# Altium project TestingPowerBoard.PrjPcb
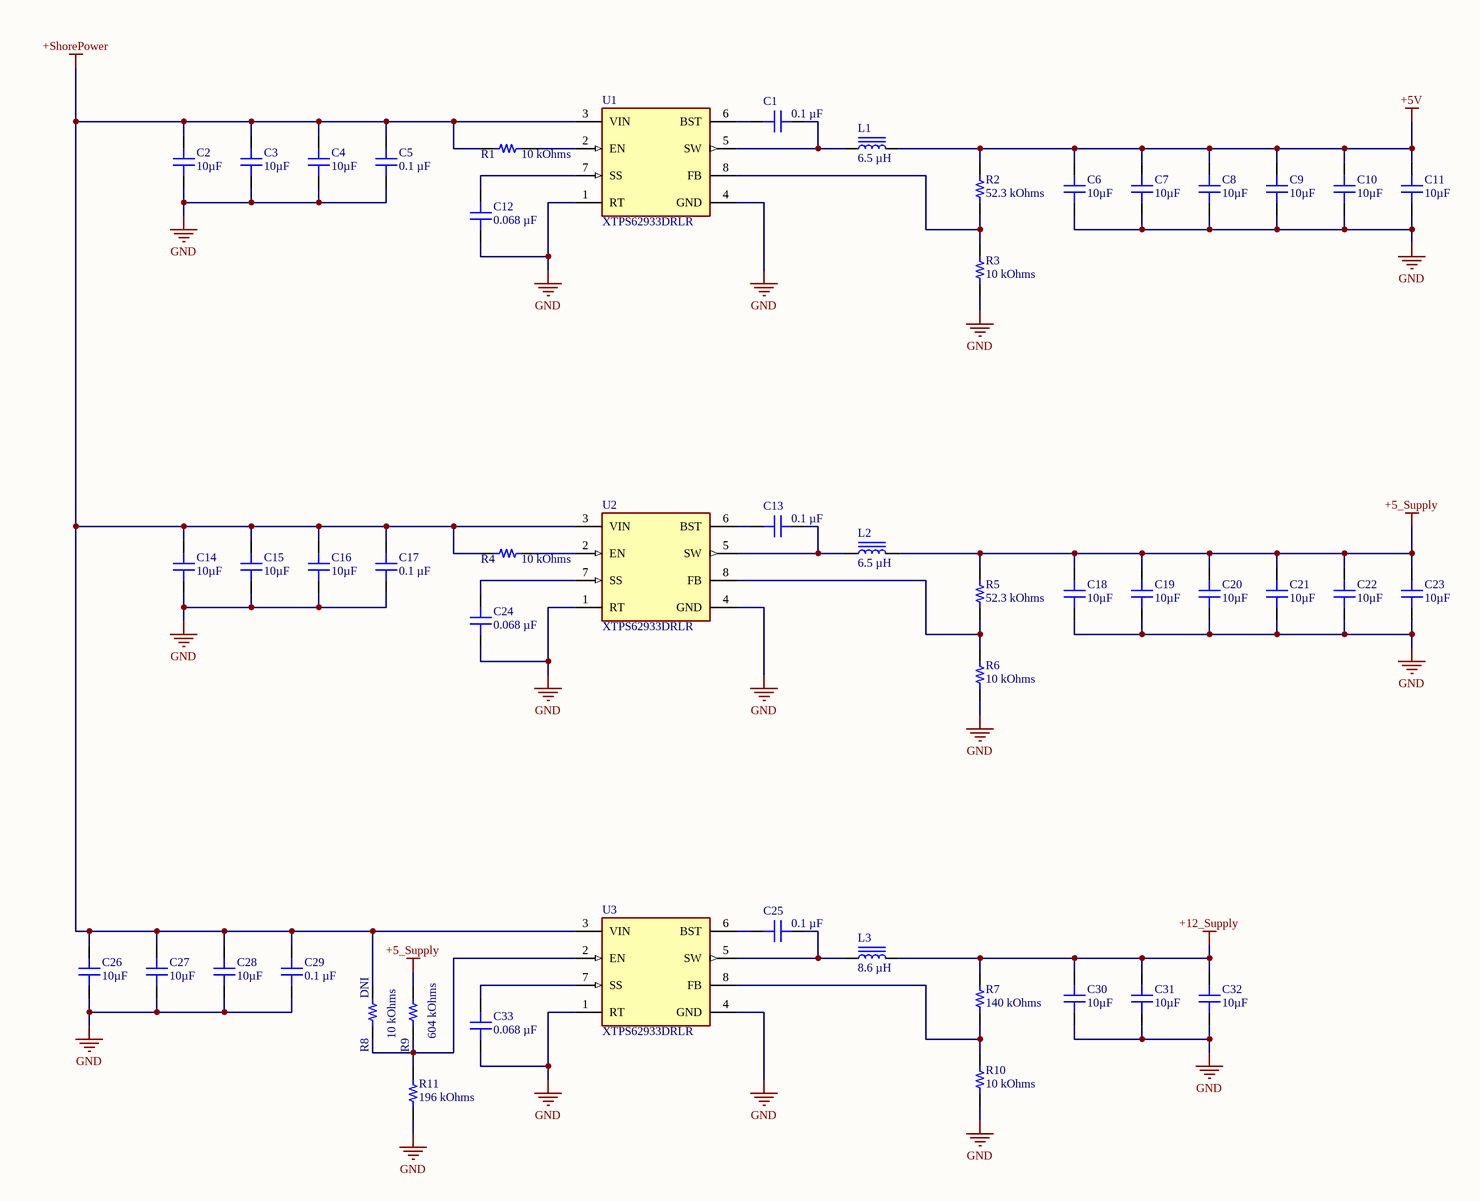
[diagram p0: Power-Supplies.SchDoc]
4 sheets, 110 parts. Net scope: flat (ports and power ports of the same name join across sheets).
Board file: TestingPowerBoard.PcbDoc
Sheets:
  Power-Supplies.SchDoc
  Interfaces.SchDoc
  Sensors.SchDoc
  Microcontroller.SchDoc

## Sheet Power-Supplies.SchDoc: Payload Card 5V Rail Power Supplies
size A2; Revision: 1A; SheetNumber: 1; SheetTotal: 3; Organization: Brickworks; Address1: Matthew Glazer; Address2: Design Engineer

### Parts
C1  0.1 µF  [CAP 0603_1608]
C2  10µF  [CAP 0805_2012]
C3  10µF  [CAP 0805_2012]
C4  10µF  [CAP 0805_2012]
C5  0.1 µF  [CAP 0603_1608]
C6  10µF  [CAP 0805_2012]
C7  10µF  [CAP 0805_2012]
C8  10µF  [CAP 0805_2012]
C9  10µF  [CAP 0805_2012]
C10  10µF  [CAP 0805_2012]
C11  10µF  [CAP 0805_2012]
C12  0.068 µF  [CAP 0603_1608]
C13  0.1 µF  [CAP 0603_1608]
C14  10µF  [CAP 0805_2012]
C15  10µF  [CAP 0805_2012]
C16  10µF  [CAP 0805_2012]
C17  0.1 µF  [CAP 0603_1608]
C18  10µF  [CAP 0805_2012]
C19  10µF  [CAP 0805_2012]
C20  10µF  [CAP 0805_2012]
C21  10µF  [CAP 0805_2012]
C22  10µF  [CAP 0805_2012]
C23  10µF  [CAP 0805_2012]
C24  0.068 µF  [CAP 0603_1608]
C25  0.1 µF  [CAP 0603_1608]
C26  10µF  [CAP 0805_2012]
C27  10µF  [CAP 0805_2012]
C28  10µF  [CAP 0805_2012]
C29  0.1 µF  [CAP 0603_1608]
C30  10µF  [CAP 0805_2012]
C31  10µF  [CAP 0805_2012]
C32  10µF  [CAP 0805_2012]
C33  0.068 µF  [CAP 0603_1608]
L1  6.5 µH  [TAIYO YUDEN NR1005]
L2  6.5 µH  [TAIYO YUDEN NR1005]
L3  8.6 µH  [BOURNS SRR6028]
R1  10 kOhms  [RES 0603_1608]
R2  52.3 kOhms  [RES 0603_1608]
R3  10 kOhms  [RES 0603_1608]
R4  10 kOhms  [RES 0603_1608]
R5  52.3 kOhms  [RES 0603_1608]
R6  10 kOhms  [RES 0603_1608]
R7  140 kOhms  [RES 0603_1608]
R8  10 kOhms  [RES 0603_1608]
R9  604 kOhms  [RES 0603_1608]
R10  10 kOhms  [RES 0603_1608]
R11  196 kOhms  [RES 0603_1608]
U1  XTPS62933DRLR  [FP-DRL0008A-MFG]
U2  XTPS62933DRLR  [FP-DRL0008A-MFG]
U3  XTPS62933DRLR  [FP-DRL0008A-MFG]

### Nets
+5_Supply: C18.2 C19.2 C20.2 C21.2 C22.2 C23.2 L2.2 R5.2 R9.2
+5V: C6.2 C7.2 C8.2 C9.2 C10.2 C11.2 L1.2 R2.2
+12_Supply: C30.2 C31.2 C32.2 L3.2 R7.2
+ShorePower: C2.2 C3.2 C4.2 C5.1 C14.2 C15.2 C16.2 C17.1 C26.2 C27.2 C28.2 C29.1 R1.1 R4.1 R8.2 U1.3(VIN) U2.3(VIN) U3.3(VIN)
GND: C2.1 C3.1 C4.1 C5.2 C6.1 C7.1 C8.1 C9.1 C10.1 C11.1 C12.1 C14.1 C15.1 C16.1 C17.2 C18.1 C19.1 C20.1 C21.1 C22.1 C23.1 C24.1 C26.1 C27.1 C28.1 C29.2 C30.1 C31.1 C32.1 C33.1 R3.1 R6.1 R10.1 R11.1 U1.1(RT) U1.4(GND) U2.1(RT) U2.4(GND) U3.1(RT) U3.4(GND)
NetC1_1: C1.1 L1.1 U1.5(SW)
NetC1_2: C1.2 U1.6(BST)
NetC12_2: C12.2 U1.7(SS)
NetC13_1: C13.1 L2.1 U2.5(SW)
NetC13_2: C13.2 U2.6(BST)
NetC24_2: C24.2 U2.7(SS)
NetC25_1: C25.1 L3.1 U3.5(SW)
NetC25_2: C25.2 U3.6(BST)
NetC33_2: C33.2 U3.7(SS)
NetR1_2: R1.2 U1.2(EN)
NetR2_1: R2.1 R3.2 U1.8(FB)
NetR4_2: R4.2 U2.2(EN)
NetR5_1: R5.1 R6.2 U2.8(FB)
NetR7_1: R7.1 R10.2 U3.8(FB)
NetR8_1: R8.1 R9.1 R11.2 U3.2(EN)

### Notes on the sheet
- (near R8) DNI
- Title
- Size:
- Date:
- File:
- A2
- Number:
- Time:
- Revision:
- Sheet
- of

### Library data of the parts
C1 C5 C13 C17 C25 C29 = CL10B104KB8NNWC: CAP CER 0.1UF 50V X7R 0603; manufacturer: Samsung Electro-Mechanics; Tolerance: ±10%; Part Number: CL10B104KB8NNWC; Value: 0.1 µF; Applications: General Purpose; Capacitance: 0.1 µF; componentlink1description: Datasheet; componentlink1url: http://www.samsungsem.com/kr/support/product-search/mlcc/CL10B104KB8NNWC.jsp; componentlink2description: DigiKey Link; componentlink2url: https://www.digikey.com/en/products/detail/samsung-electro-mechanics/CL10B104KB8NNWC/3887593; Device Package: 0603 (1608 Metric); lastupdated: 3/8/2022 9:16:52 PM; Lifecycle Status: Active; Minimum Order: 1; Mounting Type: Surface Mount, MLCC; Operating Temperature: -55°C ~ 125°C; Package / Case: 0603 (1608 Metric); packaging: CutTape; partid: 16078; Part Status: Active; price: 0.01; series: CL; Size / Dimension: 0.063" L x 0.031" W (1.60mm x 0.80mm); Supplier 1: DigiKey; Supplier Part Number 1: 1276-1935-1-ND; Temperature Coefficient: X7R; Thickness (Max): 0.035" (0.90mm); Voltage - Rated: 50V
C2-C4 C6-C11 C14-C16 C18-C23 C26-C28 C30-C32 = CC0805KKX5R7BB106: CAP CER 10UF 16V X5R 0805; Manufacturer: Yageo; Tolerance: ±10%; Part Number: CC0805KKX5R7BB106; Value: 10µF; Applications: General Purpose; Capacitance: 10µF; ComponentLink1Description: Datasheet; ComponentLink1URL: https://www.yageo.com/upload/media/product/productsearch/datasheet/mlcc/UPY-GPHC_X5R_4V-to-50V_25.pdf; ComponentLink2Description: DigiKey Link; ComponentLink2URL: http://digikey.com/product-detail/en/yageo/CC0805KKX5R7BB106/311-1865-1-ND/5195767; Device Package: 0805 (2012 Metric); LastUpdated: 9/2/2020 1:04:30 AM; Lifecycle Status: Active; Minimum Order: 1; Mounting Type: Surface Mount, MLCC; Operating Temperature: -55°C ~ 85°C; Package / Case: 0805 (2012 Metric); Packaging: TapeAndReel; PartId: 8867; Part Status: Active; Price: 0.09; Series: CC; Size / Dimension: 0.079" L x 0.049" W (2.00mm x 1.25mm); Supplier 1: DigiKey; Supplier Part Number 1: 311-1865-1-ND; Temperature Coefficient: X5R; Thickness (Max): 0.057" (1.45mm); Voltage - Rated: 16V
C12 C24 C33 = CC0603KRX7R8BB683: CAP CER 0.068UF 25V X7R 0603; manufacturer: Yageo; Tolerance: ±10%; Part Number: CC0603KRX7R8BB683; Value: 0.068 µF; Applications: General Purpose; Capacitance: 0.068 µF; componentlink1description: Datasheet; componentlink1url: https://www.yageo.com/upload/media/product/productsearch/datasheet/mlcc/UPY-GPHC_X7R_6.3V-to-50V_18.pdf; componentlink2description: DigiKey Link; componentlink2url: https://www.digikey.com/en/products/detail/yageo/CC0603KRX7R8BB683/5883792; Device Package: 0603 (1608 Metric); lastupdated: 3/17/2022 8:26:41 AM; Lifecycle Status: Active; Minimum Order: 1; Mounting Type: Surface Mount, MLCC; Operating Temperature: -55°C ~ 125°C; Package / Case: 0603 (1608 Metric); packaging: TapeAndReel; partid: 13821; Part Status: Active; price: 0.01; series: CC; Size / Dimension: 0.063" L x 0.031" W (1.60mm x 0.80mm); Supplier 1: DigiKey; Supplier Part Number 1: 311-4091-1-ND; Temperature Coefficient: X7R; Thickness (Max): 0.035" (0.90mm); Voltage - Rated: 25V
L1 L2 = NR10050T6R5N: FIXED IND 6.5UH 5.2A 23.4MOHM SM; Manufacturer: Taiyo Yuden; Current - Saturation: 6A; DC Resistance (DCR): 23.4mOhm Max; Frequency - Self Resonant: 19MHz; Inductance Frequency - Test: 100 kHz; Material - Core: Ferrite; Shielding: Shielded; Tolerance: ±30%; Type: Wirewound; Part Number: NR10050T6R5N; ComponentLink1Description: Datasheet; ComponentLink1URL: https://ds.yuden.co.jp/TYCOMPAS/ut/detail?pn=NR10050T6R5N  &u=M; ComponentLink2Description: DigiKey Link; ComponentLink2URL: https://www.digikey.com/en/products/detail/taiyo-yuden/NR10050T6R5N/1007971; Current Rating (Amps): 5.2 A; Device Package: Nonstandard; Height - Seated (Max): 0.197" (5.00mm); Inductance: 6.5 µH; LastUpdated: 3/17/2022 9:14:25 AM; Lifecycle Status: Active; Minimum Order: 1; Mounting Type: Surface Mount; Operating Temperature: -25°C ~ 105°C; Package / Case: Nonstandard; Packaging: TapeAndReel; PartId: 3626; Part Status: Active; Price: 0.51; Series: NR; Size / Dimension: 0.394" L x 0.386" W (10.00mm x 9.80mm); Supplier 1: DigiKey; Supplier Part Number 1: 587-1697-1-ND; Value: 6.5 µH
L3 = SRR6028-8R6Y: FIXED IND 8.6UH 2.1A 56 MOHM SMD; Manufacturer: Bourns Inc.; Current - Saturation: 1.82A; DC Resistance (DCR): 56mOhm Max; Frequency - Self Resonant: 28MHz; Inductance Frequency - Test: 100 kHz; Material - Core: Ferrite; Q @ Freq: 8 @ 2.52MHz; Shielding: Shielded; Tolerance: ±30%; Type: Wirewound; Part Number: SRR6028-8R6Y; ComponentLink1Description: Datasheet; ComponentLink1URL: https://www.bourns.com/docs/Product-Datasheets/SRR6028.pdf; ComponentLink2Description: DigiKey Link; ComponentLink2URL: https://www.digikey.com/en/products/detail/bourns-inc/SRR6028-8R6Y/1970374; Current Rating (Amps): 2.1 A; Device Package: Nonstandard; Height - Seated (Max): 0.118" (3.00mm); Inductance: 8.6 µH; LastUpdated: 3/17/2022 9:03:42 AM; Lifecycle Status: Active; Minimum Order: 1; Mounting Type: Surface Mount; Operating Temperature: -40°C ~ 125°C; Package / Case: Nonstandard; Packaging: TapeAndReel; PartId: 46; Part Status: Active; Price: 0.45; Series: SRR6028; Size / Dimension: 0.268" L x 0.268" W (6.80mm x 6.80mm); Supplier 1: DigiKey; Supplier Part Number 1: SRR6028-8R6YCT-ND; Value: 8.6 µH
R1 R3 R4 R6 R8 R10 = RMCF0603JT10K0: RES 10K OHM 5% 1/10W 0603; Manufacturer: Stackpole Electronics Inc; Power (Watts): 0.1W, 1/10W; Temperature Coefficient: ±200ppm/°C; Part Number: RMCF0603JT10K0; Value: 10 kOhms; ComponentLink1Description: Datasheet; ComponentLink1URL: https://www.seielect.com/catalog/sei-packaging.pdf; ComponentLink2Description: DigiKey Link; ComponentLink2URL: http://digikey.com/product-detail/en/stackpole-electronics-inc/RMCF0603JT10K0/RMCF0603JT10K0CT-ND/1943191; Composition: Thick Film; Device Package: 0603 (1608 Metric); Features: Automotive AEC-Q200; Height - Seated (Max): 0.022" (0.55mm); LastUpdated: 8/30/2020 8:48:45 PM; Lifecycle Status: Active; Minimum Order: 1; Number of Terminations: 2; Operating Temperature: -55°C ~ 155°C; Package / Case: 0603 (1608 Metric); Packaging: CutTape; PartId: 25659; Part Status: Active; Price: 0.10; Ratings: AEC-Q200; Resistance: 10 kOhms; Series: RMCF; Size / Dimension: 0.061" L x 0.031" W (1.55mm x 0.80mm); Supplier 1: DigiKey; Supplier Part Number 1: RMCF0603JT10K0CT-ND; Supplier Device Package: 0603; Tolerance: ±5%
R2 R5 = RMCF0603FT52K3: RES 52.3K OHM 1% 1/10W 0603; Manufacturer: Stackpole Electronics Inc; Power (Watts): 0.1W, 1/10W; Temperature Coefficient: ±100ppm/°C; Part Number: RMCF0603FT52K3; Value: 52.3 kOhms; ComponentLink1Description: Datasheet; ComponentLink1URL: https://www.seielect.com/catalog/sei-rmcf_rmcp.pdf; ComponentLink2Description: DigiKey Link; ComponentLink2URL: https://www.digikey.com/en/products/detail/stackpole-electronics-inc/RMCF0603FT52K3/1714113; Composition: Thick Film; Device Package: 0603 (1608 Metric); Features: Automotive AEC-Q200; Height - Seated (Max): 0.022" (0.55mm); LastUpdated: 3/17/2022 8:41:15 AM; Lifecycle Status: Active; Minimum Order: 1; Number of Terminations: 2; Operating Temperature: -55°C ~ 155°C; Package / Case: 0603 (1608 Metric); Packaging: CutTape; PartId: 26555; Part Status: Active; Price: 0.01; Ratings: AEC-Q200; Resistance: 52.3 kOhms; Series: RMCF; Size / Dimension: 0.061" L x 0.031" W (1.55mm x 0.80mm); Supplier 1: DigiKey; Supplier Part Number 1: RMCF0603FT52K3CT-ND; Supplier Device Package: 0603; Tolerance: ±1%
R7 = RMCF0603FT140K: RES 140K OHM 1% 1/10W 0603; Manufacturer: Stackpole Electronics Inc; Power (Watts): 0.1W, 1/10W; Temperature Coefficient: ±100ppm/°C; Part Number: RMCF0603FT140K; Value: 140 kOhms; ComponentLink1Description: Datasheet; ComponentLink1URL: https://www.seielect.com/catalog/sei-packaging.pdf; ComponentLink2Description: DigiKey Link; ComponentLink2URL: https://www.digikey.com/en/products/detail/stackpole-electronics-inc/RMCF0603FT140K/1761303; Composition: Thick Film; Device Package: 0603 (1608 Metric); Features: Automotive AEC-Q200; Height - Seated (Max): 0.022" (0.55mm); LastUpdated: 3/17/2022 8:42:10 AM; Lifecycle Status: Active; Minimum Order: 1; Number of Terminations: 2; Operating Temperature: -55°C ~ 155°C; Package / Case: 0603 (1608 Metric); Packaging: CutTape; PartId: 10763; Part Status: Active; Price: 0.01; Ratings: AEC-Q200; Resistance: 140 kOhms; Series: RMCF; Size / Dimension: 0.061" L x 0.031" W (1.55mm x 0.80mm); Supplier 1: DigiKey; Supplier Part Number 1: RMCF0603FT140KCT-ND; Supplier Device Package: 0603; Tolerance: ±1%
R9 = RMCF0603FT604K: RES 604K OHM 1% 1/10W 0603; Manufacturer: Stackpole Electronics Inc; Power (Watts): 0.1W, 1/10W; Temperature Coefficient: ±100ppm/°C; Part Number: RMCF0603FT604K; Value: 604 kOhms; ComponentLink1Description: Datasheet; ComponentLink1URL: https://www.seielect.com/catalog/sei-packaging.pdf; ComponentLink2Description: DigiKey Link; ComponentLink2URL: https://www.digikey.com/en/products/detail/stackpole-electronics-inc/RMCF0603FT604K/1714165; Composition: Thick Film; Device Package: 0603 (1608 Metric); Features: Automotive AEC-Q200; Height - Seated (Max): 0.022" (0.55mm); LastUpdated: 3/17/2022 8:41:50 AM; Lifecycle Status: Active; Minimum Order: 1; Number of Terminations: 2; Operating Temperature: -55°C ~ 155°C; Package / Case: 0603 (1608 Metric); Packaging: CutTape; PartId: 18486; Part Status: Active; Price: 0.01; Ratings: AEC-Q200; Resistance: 604 kOhms; Series: RMCF; Size / Dimension: 0.061" L x 0.031" W (1.55mm x 0.80mm); Supplier 1: DigiKey; Supplier Part Number 1: RMCF0603FT604KCT-ND; Supplier Device Package: 0603; Tolerance: ±1%
R11 = RMCF0603FT196K: RES 196K OHM 1% 1/10W 0603; Manufacturer: Stackpole Electronics Inc; Power (Watts): 0.1W, 1/10W; Temperature Coefficient: ±100ppm/°C; Part Number: RMCF0603FT196K; Value: 196 kOhms; ComponentLink1Description: Datasheet; ComponentLink1URL: https://www.seielect.com/catalog/sei-rmcf_rmcp.pdf; ComponentLink2Description: DigiKey Link; ComponentLink2URL: https://www.digikey.com/en/products/detail/stackpole-electronics-inc/RMCF0603FT196K/1761087; Composition: Thick Film; Device Package: 0603 (1608 Metric); Features: Automotive AEC-Q200; Height - Seated (Max): 0.022" (0.55mm); LastUpdated: 3/17/2022 8:42:07 AM; Lifecycle Status: Active; Minimum Order: 1; Number of Terminations: 2; Operating Temperature: -55°C ~ 155°C; Package / Case: 0603 (1608 Metric); Packaging: CutTape; PartId: 11666; Part Status: Active; Price: 0.01; Ratings: AEC-Q200; Resistance: 196 kOhms; Series: RMCF; Size / Dimension: 0.061" L x 0.031" W (1.55mm x 0.80mm); Supplier 1: DigiKey; Supplier Part Number 1: RMCF0603FT196KCT-ND; Supplier Device Package: 0603; Tolerance: ±1%
U1-U3 = CMP-04918-000610-1: 3.8-V to 30-V, 3-A, 200-kHz to 2.2-MHz, low-IQ synchronous buck converter in SOT-583 package 8-SOT-5X3 -40 to 150

## Sheet Interfaces.SchDoc: Payload Card Interfaces
size A3; Revision: 1A; SheetNumber: 2; SheetTotal: 4; Organization: Brickworks; Address1: Matthew Glazer; Address2: Design Engineer
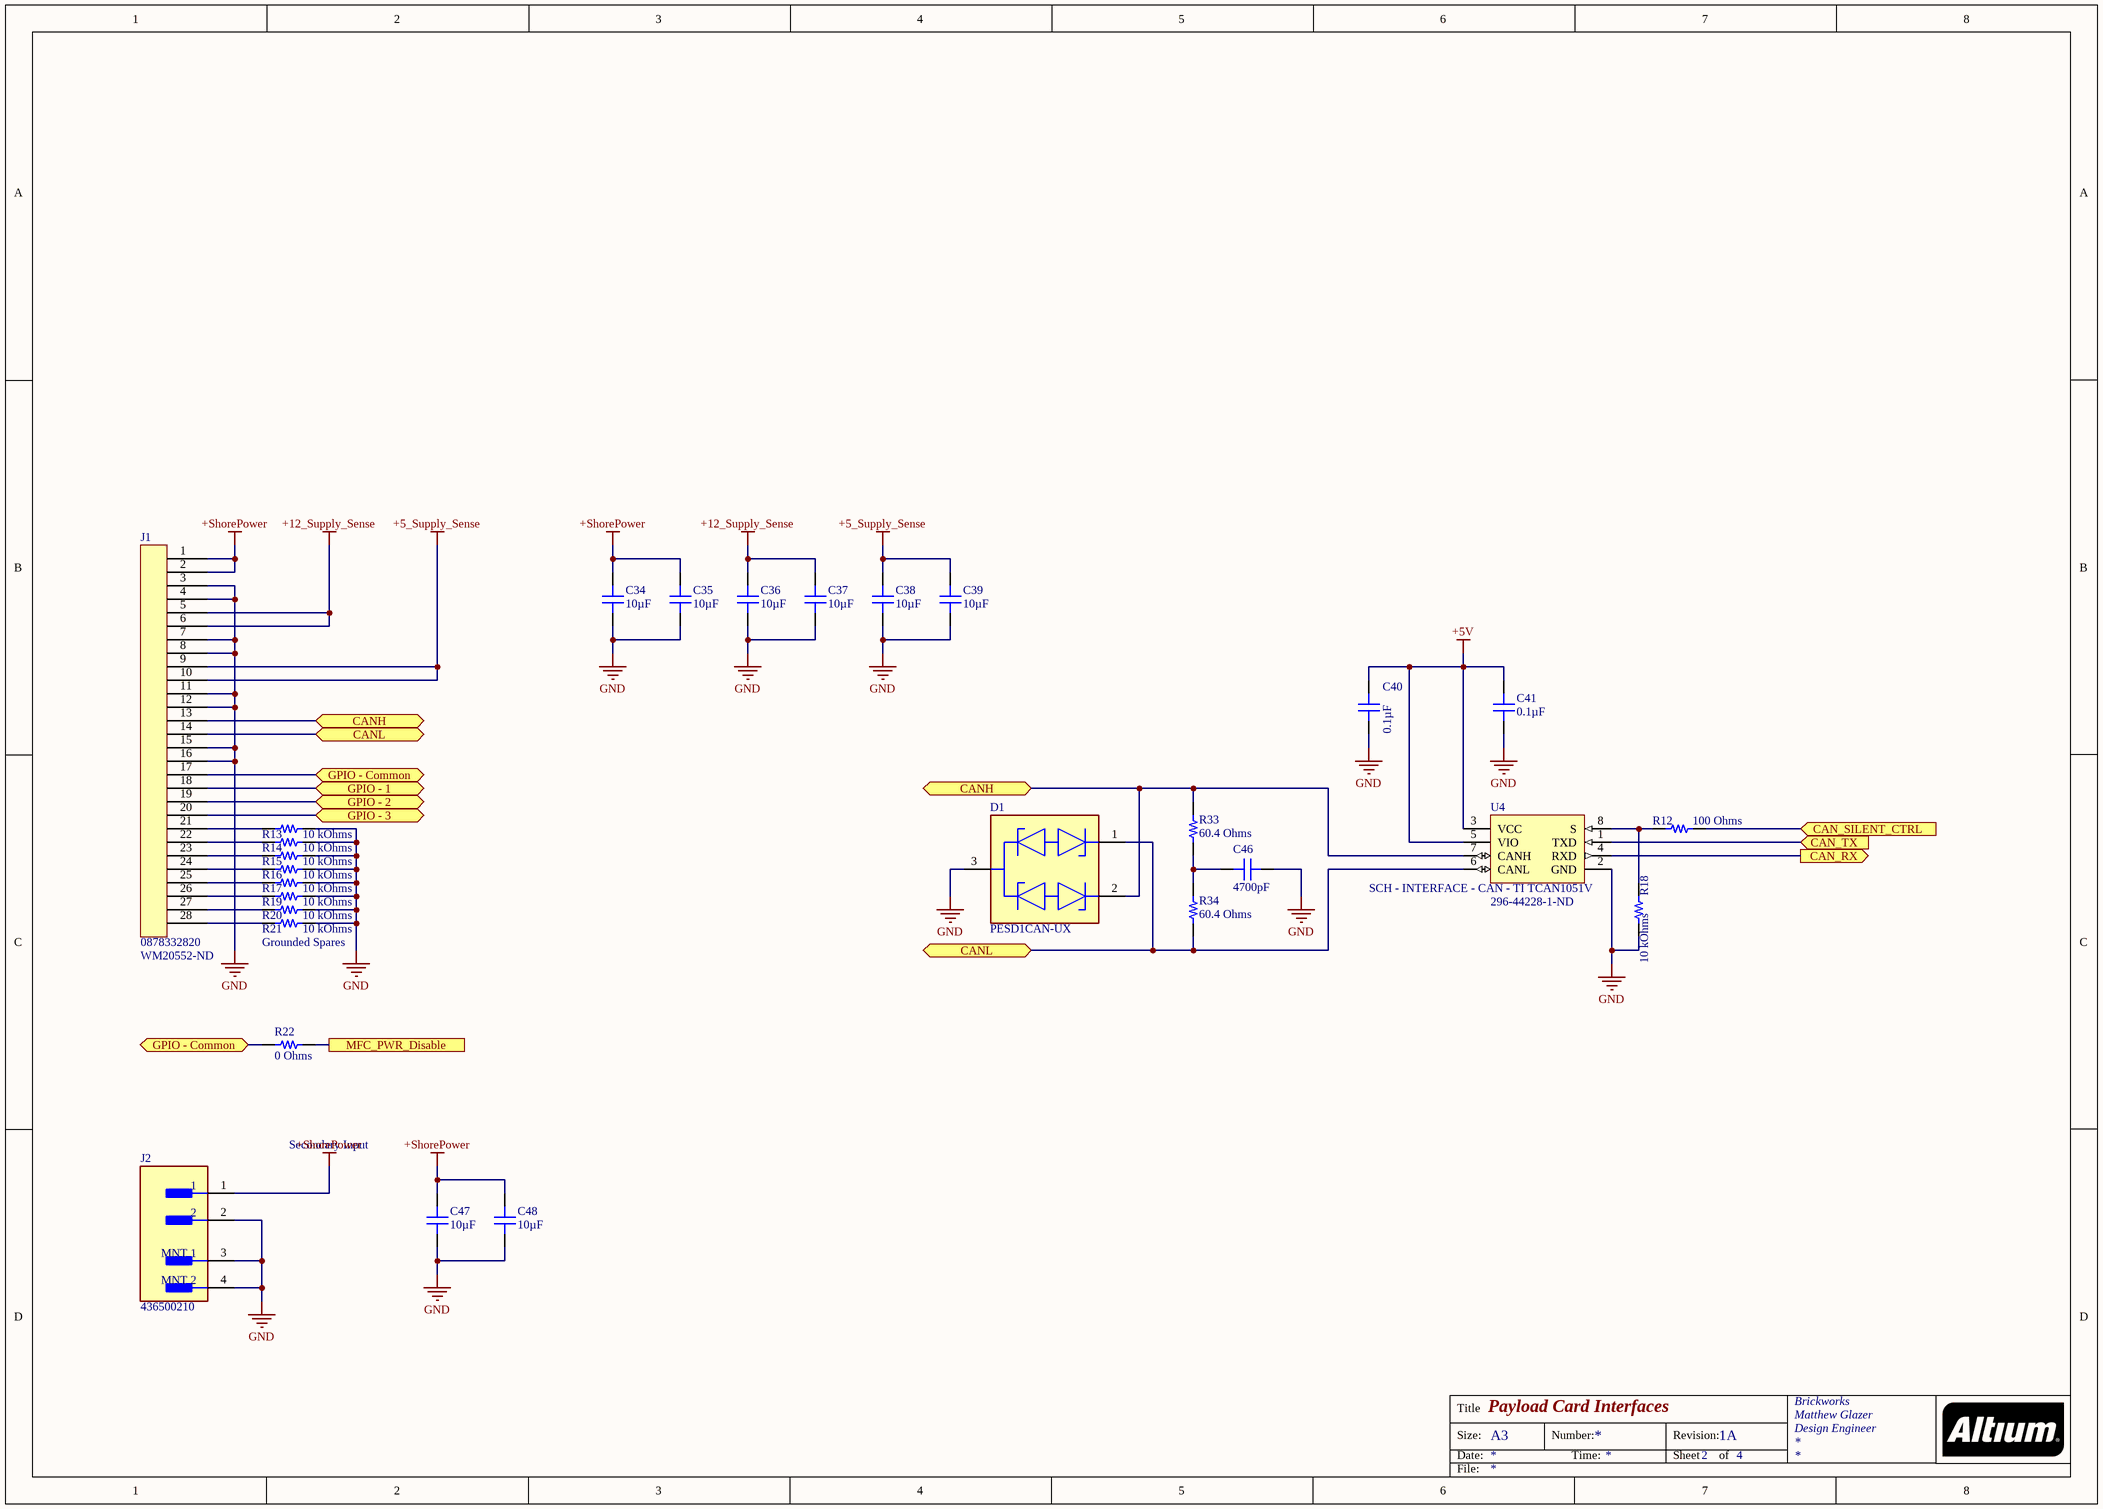
[diagram p1: Interfaces.SchDoc]

### Parts
C34  10µF  [CAP 0805_2012]
C35  10µF  [CAP 0805_2012]
C36  10µF  [CAP 0805_2012]
C37  10µF  [CAP 0805_2012]
C38  10µF  [CAP 0805_2012]
C39  10µF  [CAP 0805_2012]
C40  0.1µF  [CAP 0603_1608]
C41  0.1µF  [CAP 0603_1608]
C46  4700pF  [CAP 0603_1608]
C47  10µF  [CAP 0805_2012]
C48  10µF  [CAP 0805_2012]
D1  PESD1CAN-UX  [FP-SOT323-MFG]
J1  0878332820  Supplier Part Number 1: WM20552-ND  [0878332820]
J2  436500210  [FP-436500210-MFG]
R12  100 Ohms  [RES 0603_1608]
R13  10 kOhms  [RES 0603_1608]
R14  10 kOhms  [RES 0603_1608]
R15  10 kOhms  [RES 0603_1608]
R16  10 kOhms  [RES 0603_1608]
R17  10 kOhms  [RES 0603_1608]
R18  10 kOhms  [RES 0603_1608]
R19  10 kOhms  [RES 0603_1608]
R20  10 kOhms  [RES 0603_1608]
R21  10 kOhms  [RES 0603_1608]
R22  0 Ohms  [RES 0603_1608]
R33  60.4 Ohms  [RES 1206_3216]
R34  60.4 Ohms  [RES 1206_3216]
U4  SCH - INTERFACE - CAN - TI TCAN1051V  Supplier Part Number 1: 296-44228-1-ND  [PCB - LEADS - SOIC - TI SOIC-8]

### Ports
CAN_RX (out), CAN_SILENT_CTRL (in), CAN_TX (in), CANH (bidir), CANL (bidir), GPIO - 1 (bidir), GPIO - 2 (bidir), GPIO - 3 (bidir), GPIO - Common (bidir), MFC_PWR_Disable

### Nets
+5_Supply_Sense: C38.2 C39.2 J1.9 J1.10
+5V: C40.2 C41.2 U4.3(VCC) U4.5(VIO)
+12_Supply_Sense: C36.2 C37.2 J1.5 J1.6
+ShorePower: C34.2 C35.2 C47.2 C48.2 J1.1 J1.2 J2.1
GND: C34.1 C35.1 C36.1 C37.1 C38.1 C39.1 C40.1 C41.1 C46.2 C47.1 C48.1 D1.3(common_cathode) J1.3 J1.4 J1.7 J1.8 J1.11 J1.12 J1.15 J1.16 J2.2 J2.3(MNT_1) J2.4(MNT_2) R13.2 R14.2 R15.2 R16.2 R17.2 R18.1 R19.2 R20.2 R21.2 U4.2(GND)
NetC46_1: C46.1 R33.1 R34.2
NetD1_1: D1.1(cathode_1) J1.14 R34.1 U4.6(CANL) ; port CANL
NetD1_2: D1.2(cathode_2) J1.13 R33.2 U4.7(CANH) ; port CANH
NetJ1_17: J1.17 R22.1 ; port GPIO - Common
NetJ1_18: J1.18 ; port GPIO - 1
NetJ1_19: J1.19 ; port GPIO - 2
NetJ1_20: J1.20 ; port GPIO - 3
NetJ1_21: J1.21 R13.1
NetJ1_22: J1.22 R14.1
NetJ1_23: J1.23 R15.1
NetJ1_24: J1.24 R16.1
NetJ1_25: J1.25 R17.1
NetJ1_26: J1.26 R19.1
NetJ1_27: J1.27 R20.1
NetJ1_28: J1.28 R21.1
NetP1_2: R12.2 ; port CAN_SILENT_CTRL
NetP1_3: U4.1(TXD) ; port CAN_TX
NetP1_4: U4.4(RXD) ; port CAN_RX
NetP7_4: R22.2 ; port MFC_PWR_Disable
NetR12_1: R12.1 R18.2 U4.8(S)

### Notes on the sheet
- (near R21) Grounded Spares
- (near J2) Secondary Input
- Title
- Size:
- Date:
- A3
- Number:
- Time:
- Revision:
- Sheet
- of
- File:

### Library data of the parts
C34-C39 C47 C48 = CC0805KKX5R7BB106: as C2 on sheet Power-Supplies; Part Number: CC0805KKX5R7BB106; Value: 10µF; Applications: General Purpose; Capacitance: 10µF; ComponentLink1Description: Datasheet; ComponentLink1URL: https://www.yageo.com/upload/media/product/productsearch/datasheet/mlcc/UPY-GPHC_X5R_4V-to-50V_25.pdf; ComponentLink2Description: DigiKey Link; ComponentLink2URL: http://digikey.com/product-detail/en/yageo/CC0805KKX5R7BB106/311-1865-1-ND/5195767; Device Package: 0805 (2012 Metric); LastUpdated: 9/2/2020 1:04:30 AM; Lifecycle Status: Active; Minimum Order: 1; Mounting Type: Surface Mount, MLCC; Operating Temperature: -55°C ~ 85°C; Package / Case: 0805 (2012 Metric); Packaging: TapeAndReel; PartId: 8867; Part Status: Active; Price: 0.09; Series: CC; Size / Dimension: 0.079" L x 0.049" W (2.00mm x 1.25mm); Supplier 1: DigiKey; Supplier Part Number 1: 311-1865-1-ND; Temperature Coefficient: X5R; Thickness (Max): 0.057" (1.45mm); Voltage - Rated: 16V
C40 C41 = CL10B104KA8WPNC: CAP CER 0.1UF 25V X7R 0603; Manufacturer: Samsung Electro-Mechanics; Tolerance: ±10%; Part Number: CL10B104KA8WPNC; Value: 0.1µF; Applications: Automotive; Capacitance: 0.1µF; ComponentLink1Description: Datasheet; ComponentLink1URL: http://www.samsungsem.com/kr/support/product-search/mlcc/CL10B104KA8WPNC.jsp; ComponentLink2Description: DigiKey Link; ComponentLink2URL: http://digikey.com/product-detail/en/samsung-electro-mechanics/CL10B104KA8WPNC/1276-6717-1-ND/5961576; Device Package: 0603 (1608 Metric); Features: Open Mode; LastUpdated: 9/2/2020 1:03:30 AM; Lifecycle Status: Active; Minimum Order: 1; Mounting Type: Surface Mount, MLCC; Operating Temperature: -55°C ~ 125°C; Package / Case: 0603 (1608 Metric); Packaging: TapeAndReel; PartId: 5631; Part Status: Active; Price: 0.02; Ratings: AEC-Q200; Series: CL; Size / Dimension: 0.063" L x 0.031" W (1.60mm x 0.80mm); Supplier 1: DigiKey; Supplier Part Number 1: 1276-6717-1-ND; Temperature Coefficient: X7R; Thickness (Max): 0.035" (0.90mm); Voltage - Rated: 25V
C46 = VJ0603Y472KXACW1BC: CAP CER 4700PF 50V X7R 0603; Manufacturer: Vishay Vitramon; Tolerance: ±10%; Part Number: VJ0603Y472KXACW1BC; Value: 4700pF; Applications: General Purpose; Capacitance: 4700pF; ComponentLink1Description: Datasheet; ComponentLink1URL: https://www.vishay.com/docs/28548/vjw1bcbascomseries.pdf; ComponentLink2Description: DigiKey Link; ComponentLink2URL: http://digikey.com/product-detail/en/vishay-vitramon/VJ0603Y472KXACW1BC/720-1530-1-ND/421007; Device Package: 0603 (1608 Metric); LastUpdated: 9/2/2020 1:03:13 AM; Lifecycle Status: Active; Minimum Order: 1; Mounting Type: Surface Mount, MLCC; Operating Temperature: -55°C ~ 125°C; Package / Case: 0603 (1608 Metric); Packaging: TapeAndReel; PartId: 14247; Part Status: Active; Price: 0.01; Series: VJ; Size / Dimension: 0.063" L x 0.031" W (1.60mm x 0.80mm); Supplier 1: DigiKey; Supplier Part Number 1: 720-1530-1-ND; Temperature Coefficient: X7R; Thickness (Max): 0.035" (0.90mm); Voltage - Rated: 50V
D1 = CMP-14436-000006-1: TVS DIODE 24V 50V SC70-3
J2 = CMP-04776-000082-1: CONN HEADER SMD R/A 2POS 3MM; Manufacturer: Molex; Voltage Rating: 600V; Current Rating: 8.5A; Conn Orientation: Right Angle; Number Of Contacts: 2; Conn Gender: Male; Device Class L3: unset; Contact Material: Gold,Nickel; RoHS: TRUE; Number Of Rows: 1; Manufacturer Part Number: 436500210; Category: Conn; Footprint Url: https://www.molex.com/pdm_docs/sd/436500210_sd.pdf; Temperature Range High: +105°C; Package: 436500210; Pitch: 3mm; Temperature: -40°C to +105°C; Height: 6.07mm; Lead Free: Yes; ComponentLink2Description: Datasheet; Temperature Range Low: -40°C; Digikey Description: CONN HEADER SMD R/A 2POS 3MM; Device Class L1: Connectors; Mouser Description: Conn Power HDR 2 POS 3mm Solder RA SMD 2 Terminal 1 Port Embossed T/R; ComponentLink2URL: https://www.molex.com/webdocs/datasheets/pdf/en-us/0436500210_PCB_HEADERS.pdf; Octopart: https://octopart.com/43650-0210-molex-298097; Automotive: No; Device Class L2: Headers and Wire Housings
R12 = RMCF0603FG100R: RES 100 OHM 1% 1/10W 0603; Manufacturer: Stackpole Electronics Inc; Power (Watts): 0.1W, 1/10W; Temperature Coefficient: ±100ppm/°C; Part Number: RMCF0603FG100R; Value: 100 Ohms; ComponentLink1Description: Datasheet; ComponentLink1URL: https://www.seielect.com/catalog/sei-rmcf_rmcp.pdf; ComponentLink2Description: DigiKey Link; ComponentLink2URL: http://digikey.com/product-detail/en/stackpole-electronics-inc/RMCF0603FG100R/RMCF0603FG100RCT-ND/4425033; Composition: Thick Film; Device Package: 0603 (1608 Metric); Features: Automotive AEC-Q200; Height - Seated (Max): 0.022" (0.55mm); LastUpdated: 9/2/2020 1:09:39 AM; Lifecycle Status: Active; Minimum Order: 1; Number of Terminations: 2; Operating Temperature: -55°C ~ 155°C; Package / Case: 0603 (1608 Metric); Packaging: CutTape; PartId: 24036; Part Status: Active; Price: 0.10; Ratings: AEC-Q200; Resistance: 100 Ohms; Series: RMCF; Size / Dimension: 0.061" L x 0.031" W (1.55mm x 0.80mm); Supplier 1: DigiKey; Supplier Part Number 1: RMCF0603FG100RCT-ND; Supplier Device Package: 0603; Tolerance: ±1%
R13-R21 = RMCF0603JT10K0: as R1 on sheet Power-Supplies; Part Number: RMCF0603JT10K0; Value: 10 kOhms; ComponentLink1Description: Datasheet; ComponentLink1URL: https://www.seielect.com/catalog/sei-packaging.pdf; ComponentLink2Description: DigiKey Link; ComponentLink2URL: http://digikey.com/product-detail/en/stackpole-electronics-inc/RMCF0603JT10K0/RMCF0603JT10K0CT-ND/1943191; Composition: Thick Film; Device Package: 0603 (1608 Metric); Features: Automotive AEC-Q200; Height - Seated (Max): 0.022" (0.55mm); LastUpdated: 8/30/2020 8:48:45 PM; Lifecycle Status: Active; Minimum Order: 1; Number of Terminations: 2; Operating Temperature: -55°C ~ 155°C; Package / Case: 0603 (1608 Metric); Packaging: CutTape; PartId: 25659; Part Status: Active; Price: 0.10; Ratings: AEC-Q200; Resistance: 10 kOhms; Series: RMCF; Size / Dimension: 0.061" L x 0.031" W (1.55mm x 0.80mm); Supplier 1: DigiKey; Supplier Part Number 1: RMCF0603JT10K0CT-ND; Supplier Device Package: 0603; Tolerance: ±5%
R22 = RMCF0603ZT0R00: RES 0 OHM JUMPER 1/10W 0603; Manufacturer: Stackpole Electronics Inc; Power (Watts): 0.1W, 1/10W; Part Number: RMCF0603ZT0R00; Value: 0 Ohms; ComponentLink1Description: Datasheet; ComponentLink1URL: https://www.seielect.com/catalog/sei-rmcf_rmcp.pdf; ComponentLink2Description: DigiKey Link; ComponentLink2URL: http://digikey.com/product-detail/en/stackpole-electronics-inc/RMCF0603ZT0R00/RMCF0603ZT0R00CT-ND/1943218; Composition: Thick Film; Device Package: 0603 (1608 Metric); Features: Automotive AEC-Q200; Height - Seated (Max): 0.022" (0.55mm); LastUpdated: 9/2/2020 1:09:45 AM; Lifecycle Status: Active; Minimum Order: 1; Number of Terminations: 2; Operating Temperature: -55°C ~ 155°C; Package / Case: 0603 (1608 Metric); Packaging: CutTape; PartId: 22613; Part Status: Active; Price: 0.10; Ratings: AEC-Q200; Resistance: 0 Ohms; Series: RMCF; Size / Dimension: 0.061" L x 0.031" W (1.55mm x 0.80mm); Supplier 1: DigiKey; Supplier Part Number 1: RMCF0603ZT0R00CT-ND; Supplier Device Package: 0603; Tolerance: Jumper
R33 R34 = ESR18EZPF60R4: RES SMD 60.4 OHM 1% 1/2W 1206; Manufacturer: Rohm Semiconductor; Power (Watts): 0.5W, 1/2W; Temperature Coefficient: ±100ppm/°C; Part Number: ESR18EZPF60R4; ComponentLink1Description: Datasheet; ComponentLink1URL: https://www.rohm.com/datasheet/ESR01MZPF/esr-e; ComponentLink2Description: DigiKey Link; ComponentLink2URL: http://digikey.com/product-detail/en/rohm-semiconductor/ESR18EZPF60R4/RHM60.4AFCT-ND/1983938; Composition: Thick Film; Device Package: 1206 (3216 Metric); Features: Automotive AEC-Q200, Pulse Withstanding; Height - Seated (Max): 0.026" (0.65mm); LastUpdated: 9/2/2020 1:12:41 AM; Lifecycle Status: Active; Minimum Order: 1; Number of Terminations: 2; Operating Temperature: -55°C ~ 155°C; Package / Case: 1206 (3216 Metric); Packaging: TapeAndReel; PartId: 38901; Part Status: Active; Price: 0.02; Ratings: AEC-Q200; Resistance: 60.4 Ohms; Series: ESR; Size / Dimension: 0.126" L x 0.063" W (3.20mm x 1.60mm); Supplier 1: DigiKey; Supplier Part Number 1: RHM60.4AFCT-ND; Supplier Device Package: 1206; Tolerance: ±1%; Value: 60.4 Ohms
J1 = 0878332820: Supplier 1: Digi-Key
U4 = SCH - INTERFACE - CAN - TI TCAN1051V: Supplier 1: Digi-Key

## Sheet Sensors.SchDoc: Payload Card Sensors
size A3; Revision: 1A; SheetNumber: 3; SheetTotal: 3; Organization: Brickworks; Address1: Matthew Glazer; Address2: Design Engineer
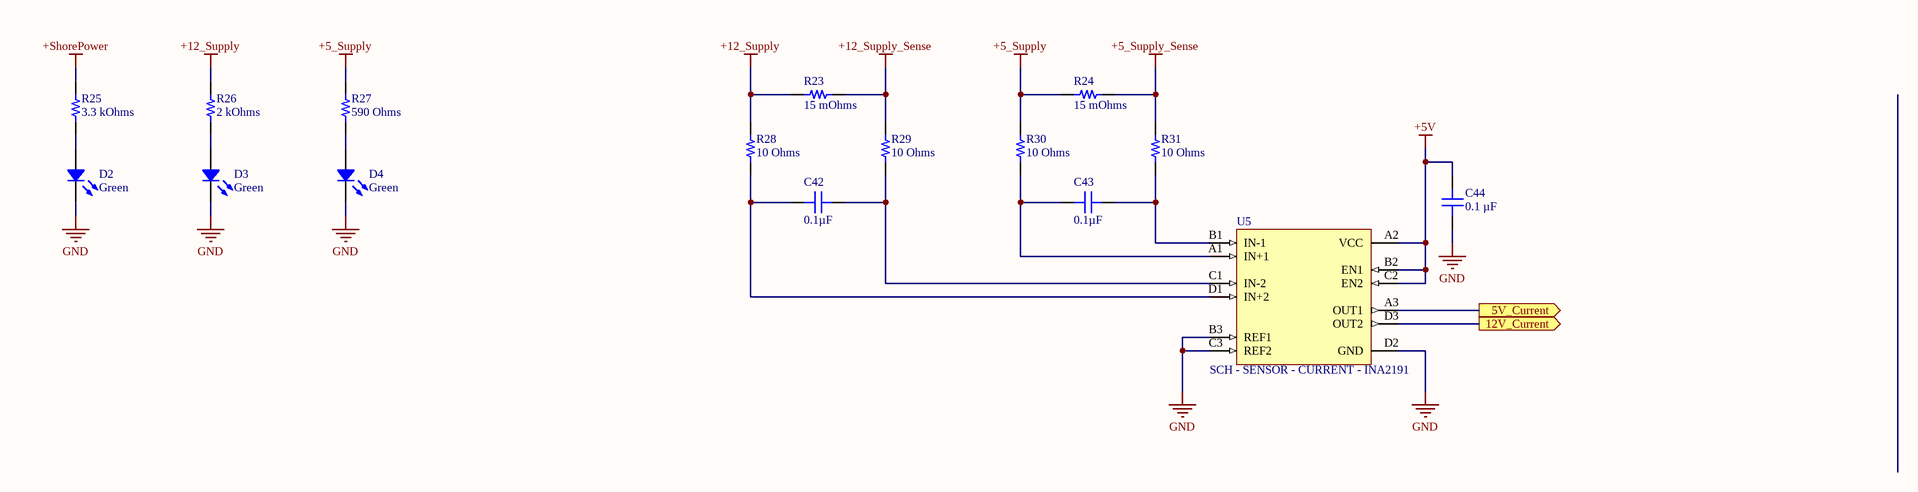
[diagram p2: Sensors.SchDoc]

### Parts
C42  0.1µF  [CAP 0603_1608]
C43  0.1µF  [CAP 0603_1608]
C44  0.1 µF  [CAP 0603_1608]
D2  Green  [LED 0603_1608 GREEN]
D3  Green  [LED 0603_1608 GREEN]
D4  Green  [LED 0603_1608 GREEN]
R23  15 mOhms  [RES 1206_3216]
R24  15 mOhms  [RES 1206_3216]
R25  3.3 kOhms  [RES 0603_1608]
R26  2 kOhms  [RES 0603_1608]
R27  590 Ohms  [RES 0603_1608]
R28  10 Ohms  [RES 0603_1608]
R29  10 Ohms  [RES 0603_1608]
R30  10 Ohms  [RES 0603_1608]
R31  10 Ohms  [RES 0603_1608]
U5  SCH - SENSOR - CURRENT - INA2191  [PCB - LEADLESS - BGA - TI DSBGA-12]

### Ports
5V_Current (out), 12V_Current (out)

### Nets
+5_Supply: R24.1 R27.2 R30.2
+5_Supply_Sense: R24.2 R31.2
+5V: C44.1 U5.A2(VCC) U5.B2(EN1) U5.C2(EN2)
+12_Supply: R23.1 R26.2 R28.2
+12_Supply_Sense: R23.2 R29.2
+ShorePower: R25.2
GND: C44.2 D2.2 D3.2 D4.2 U5.B3(REF1) U5.C3(REF2) U5.D2(GND)
NetC42_1: C42.1 R29.1 U5.C1(IN-2)
NetC42_2: C42.2 R28.1 U5.D1(IN+2)
NetC43_1: C43.1 R31.1 U5.B1(IN-1)
NetC43_2: C43.2 R30.1 U5.A1(IN+1)
NetD2_1: D2.1 R25.1
NetD3_1: D3.1 R26.1
NetD4_1: D4.1 R27.1
NetP6_4: U5.D3(OUT2) ; port 12V_Current
NetP8_1: U5.A3(OUT1) ; port 5V_Current

### Notes on the sheet
- Title
- Size:
- Date:
- A3
- Number:
- Time:
- Revision:
- Sheet
- of
- File:

### Library data of the parts
C42 C43 = CL10B104KA8WPNC: as C40 on sheet Interfaces; Part Number: CL10B104KA8WPNC; Value: 0.1µF; Applications: Automotive; Capacitance: 0.1µF; ComponentLink1Description: Datasheet; ComponentLink1URL: http://www.samsungsem.com/kr/support/product-search/mlcc/CL10B104KA8WPNC.jsp; ComponentLink2Description: DigiKey Link; ComponentLink2URL: http://digikey.com/product-detail/en/samsung-electro-mechanics/CL10B104KA8WPNC/1276-6717-1-ND/5961576; Device Package: 0603 (1608 Metric); Features: Open Mode; LastUpdated: 9/2/2020 1:03:30 AM; Lifecycle Status: Active; Minimum Order: 1; Mounting Type: Surface Mount, MLCC; Operating Temperature: -55°C ~ 125°C; Package / Case: 0603 (1608 Metric); Packaging: TapeAndReel; PartId: 5631; Part Status: Active; Price: 0.02; Ratings: AEC-Q200; Series: CL; Size / Dimension: 0.063" L x 0.031" W (1.60mm x 0.80mm); Supplier 1: DigiKey; Supplier Part Number 1: 1276-6717-1-ND; Temperature Coefficient: X7R; Thickness (Max): 0.035" (0.90mm); Voltage - Rated: 25V
C44 = CL10B104KB8NNWC: as C1 on sheet Power-Supplies; Part Number: CL10B104KB8NNWC; Value: 0.1 µF; Applications: General Purpose; Capacitance: 0.1 µF; componentlink1description: Datasheet; componentlink1url: http://www.samsungsem.com/kr/support/product-search/mlcc/CL10B104KB8NNWC.jsp; componentlink2description: DigiKey Link; componentlink2url: https://www.digikey.com/en/products/detail/samsung-electro-mechanics/CL10B104KB8NNWC/3887593; Device Package: 0603 (1608 Metric); lastupdated: 3/8/2022 9:16:52 PM; Lifecycle Status: Active; Minimum Order: 1; Mounting Type: Surface Mount, MLCC; Operating Temperature: -55°C ~ 125°C; Package / Case: 0603 (1608 Metric); packaging: CutTape; partid: 16078; Part Status: Active; price: 0.01; series: CL; Size / Dimension: 0.063" L x 0.031" W (1.60mm x 0.80mm); Supplier 1: DigiKey; Supplier Part Number 1: 1276-1935-1-ND; Temperature Coefficient: X7R; Thickness (Max): 0.035" (0.90mm); Voltage - Rated: 50V
D2-D4 = LTST-C193KGKT-5A: LED GREEN CLEAR CHIP SMD; Manufacturer: Lite-On Inc.; Configuration: Standard; Current - Test: 5mA; Lens Color: Colorless; Lens Size: 1.15mm x 0.80mm; Lens Style: Rectangle with Flat Top; Millicandela Rating: 16.25mcd; Viewing Angle: 130°; Voltage - Forward (Vf) (Typ): 2V; Wavelength - Dominant: 572nm; Wavelength - Peak: 574nm; Part Number: LTST-C193KGKT-5A; Color: Green; ComponentLink1Description: Datasheet; ComponentLink1URL: http://optoelectronics.liteon.com/upload/download/DS22-2007-0094/LTST-C193KGKT-5A.PDF; ComponentLink2Description: DigiKey Link; ComponentLink2URL: http://digikey.com/product-detail/en/lite-on-inc/LTST-C193KGKT-5A/160-1828-1-ND/2356247; Device Package: 0603 (1608 Metric); Height (Max): 0.45mm; LastUpdated: 9/2/2020 1:20:41 AM; Lens Transparency: Clear; Lifecycle Status: Active; Minimum Order: 1; Mounting Type: Surface Mount; Package / Case: 0603 (1608 Metric); Packaging: TapeAndReel; PartId: 694; Part Status: Active; Price: 0.06; Series: -; Size / Dimension: 1.60mm L x 0.80mm W; Supplier 1: DigiKey; Supplier Part Number 1: 160-1828-1-ND; Supplier Device Package: Chip LED; Value: Green
R23 R24 = L4T12FR015FER: RES 0.015 OHM 1% 1/2W 1206; Manufacturer: Ohmite; Power (Watts): 0.5W, 1/2W; Temperature Coefficient: ±75ppm/°C; Part Number: L4T12FR015FER; ComponentLink1Description: Datasheet; ComponentLink1URL: https://www.ohmite.com/assets/docs/acl_l4t.pdf; ComponentLink2Description: DigiKey Link; ComponentLink2URL: https://www.digikey.com/en/products/detail/ohmite/L4T12FR015FER/10385194; Composition: Thick Film; Device Package: 1206 (3216 Metric); Features: Current Sense; Height - Seated (Max): 0.026" (0.65mm); LastUpdated: 3/17/2022 8:47:48 AM; Lifecycle Status: Active; Minimum Order: 1; Number of Terminations: 4; Operating Temperature: -55°C ~ 155°C; Package / Case: 1206 (3216 Metric); Packaging: TapeAndReel; PartId: 28335; Part Status: Active; Price: 0.07; Resistance: 15 mOhms; Series: L4T12; Size / Dimension: 0.118" L x 0.063" W (3.00mm x 1.60mm); Supplier 1: DigiKey; Supplier Part Number 1: 273-L4T12FR015FERCT-ND; Supplier Device Package: 1206; Tolerance: ±1%; Value: 15 mOhms
R25 = RMCF0603FT3K30: RES 3.3K OHM 1% 1/10W 0603; Manufacturer: Stackpole Electronics Inc; Power (Watts): 0.1W, 1/10W; Temperature Coefficient: ±100ppm/°C; Part Number: RMCF0603FT3K30; Value: 3.3 kOhms; ComponentLink1Description: Datasheet; ComponentLink1URL: https://www.seielect.com/catalog/sei-rmcf_rmcp.pdf; ComponentLink2Description: DigiKey Link; ComponentLink2URL: https://www.digikey.com/en/products/detail/stackpole-electronics-inc/RMCF0603FT3K30/1761032; Composition: Thick Film; Device Package: 0603 (1608 Metric); Features: Automotive AEC-Q200; Height - Seated (Max): 0.022" (0.55mm); LastUpdated: 3/17/2022 8:42:21 AM; Lifecycle Status: Active; Minimum Order: 1; Number of Terminations: 2; Operating Temperature: -55°C ~ 155°C; Package / Case: 0603 (1608 Metric); Packaging: CutTape; PartId: 6090; Part Status: Active; Price: 0.01; Ratings: AEC-Q200; Resistance: 3.3 kOhms; Series: RMCF; Size / Dimension: 0.061" L x 0.031" W (1.55mm x 0.80mm); Supplier 1: DigiKey; Supplier Part Number 1: RMCF0603FT3K30CT-ND; Supplier Device Package: 0603; Tolerance: ±1%
R26 = RNCP0603FTD2K00: RES 2K OHM 1% 1/8W 0603; Manufacturer: Stackpole Electronics Inc; Power (Watts): 0.125W, 1/8W; Temperature Coefficient: ±100ppm/°C; Part Number: RNCP0603FTD2K00; Value: 2 kOhms; ComponentLink1Description: Datasheet; ComponentLink1URL: https://www.seielect.com/catalog/sei-rncp.pdf; ComponentLink2Description: DigiKey Link; ComponentLink2URL: https://www.digikey.com/en/products/detail/stackpole-electronics-inc/RNCP0603FTD2K00/2240114; Composition: Thin Film; Device Package: 0603 (1608 Metric); Features: Anti-Sulfur; Height - Seated (Max): 0.022" (0.55mm); LastUpdated: 3/17/2022 8:42:12 AM; Lifecycle Status: Active; Minimum Order: 1; Number of Terminations: 2; Operating Temperature: -55°C ~ 155°C; Package / Case: 0603 (1608 Metric); Packaging: TapeAndReel; PartId: 9714; Part Status: Active; Price: 0.01; Resistance: 2 kOhms; Series: RNCP; Size / Dimension: 0.061" L x 0.031" W (1.55mm x 0.80mm); Supplier 1: DigiKey; Supplier Part Number 1: RNCP0603FTD2K00CT-ND; Supplier Device Package: 0603; Tolerance: ±1%
R27 = RMCF0603FT590R: RES 590 OHM 1% 1/10W 0603; Manufacturer: Stackpole Electronics Inc; Power (Watts): 0.1W, 1/10W; Temperature Coefficient: ±100ppm/°C; Part Number: RMCF0603FT590R; Value: 590 Ohms; ComponentLink1Description: Datasheet; ComponentLink1URL: https://www.seielect.com/catalog/sei-rmcf_rmcp.pdf; ComponentLink2Description: DigiKey Link; ComponentLink2URL: http://digikey.com/product-detail/en/stackpole-electronics-inc/RMCF0603FT590R/RMCF0603FT590RCT-ND/2418096; Composition: Thick Film; Device Package: 0603 (1608 Metric); Features: Automotive AEC-Q200; Height - Seated (Max): 0.022" (0.55mm); LastUpdated: 9/2/2020 1:09:40 AM; Lifecycle Status: Active; Minimum Order: 1; Number of Terminations: 2; Operating Temperature: -55°C ~ 155°C; Package / Case: 0603 (1608 Metric); Packaging: CutTape; PartId: 23847; Part Status: Active; Price: 0.10; Ratings: AEC-Q200; Resistance: 590 Ohms; Series: RMCF; Size / Dimension: 0.061" L x 0.031" W (1.55mm x 0.80mm); Supplier 1: DigiKey; Supplier Part Number 1: RMCF0603FT590RCT-ND; Supplier Device Package: 0603; Tolerance: ±1%
R28-R31 = CRGCQ0603F10R: CRGCQ 0603 10R 1%; Manufacturer: TE Connectivity Passive Product; Power (Watts): 0.1W, 1/10W; Temperature Coefficient: ±400ppm/°C; Part Number: CRGCQ0603F10R; Value: 10 Ohms; ComponentLink1Description: Datasheet; ComponentLink1URL: https://www.te.com/commerce/DocumentDelivery/DDEController?Action=srchrtrv&DocNm=1773204-3&DocType=DS&DocLang=English; ComponentLink2Description: DigiKey Link; ComponentLink2URL: http://digikey.com/product-detail/en/te-connectivity-passive-product/CRGCQ0603F10R/A129664CT-ND/8577496; Composition: Thick Film; Device Package: 0603 (1608 Metric); Features: Automotive AEC-Q200, Moisture Resistant; Height - Seated (Max): 0.022" (0.55mm); LastUpdated: 9/2/2020 1:09:39 AM; Lifecycle Status: Active; Minimum Order: 1; Number of Terminations: 2; Operating Temperature: -55°C ~ 155°C; Package / Case: 0603 (1608 Metric); Packaging: CutTape; PartId: 23975; Part Status: Active; Price: 0.10; Ratings: AEC-Q200; Resistance: 10 Ohms; Series: CRGCQ; Size / Dimension: 0.063" L x 0.031" W (1.60mm x 0.80mm); Supplier 1: DigiKey; Supplier Part Number 1: A129664CT-ND; Supplier Device Package: 0603; Tolerance: ±1%

## Sheet Microcontroller.SchDoc: Payload Card Microcontroller
size A2; Revision: 1A; SheetNumber: 4; SheetTotal: 4; Organization: Brickworks; Address1: Matthew Glazer; Address2: Design Engineer
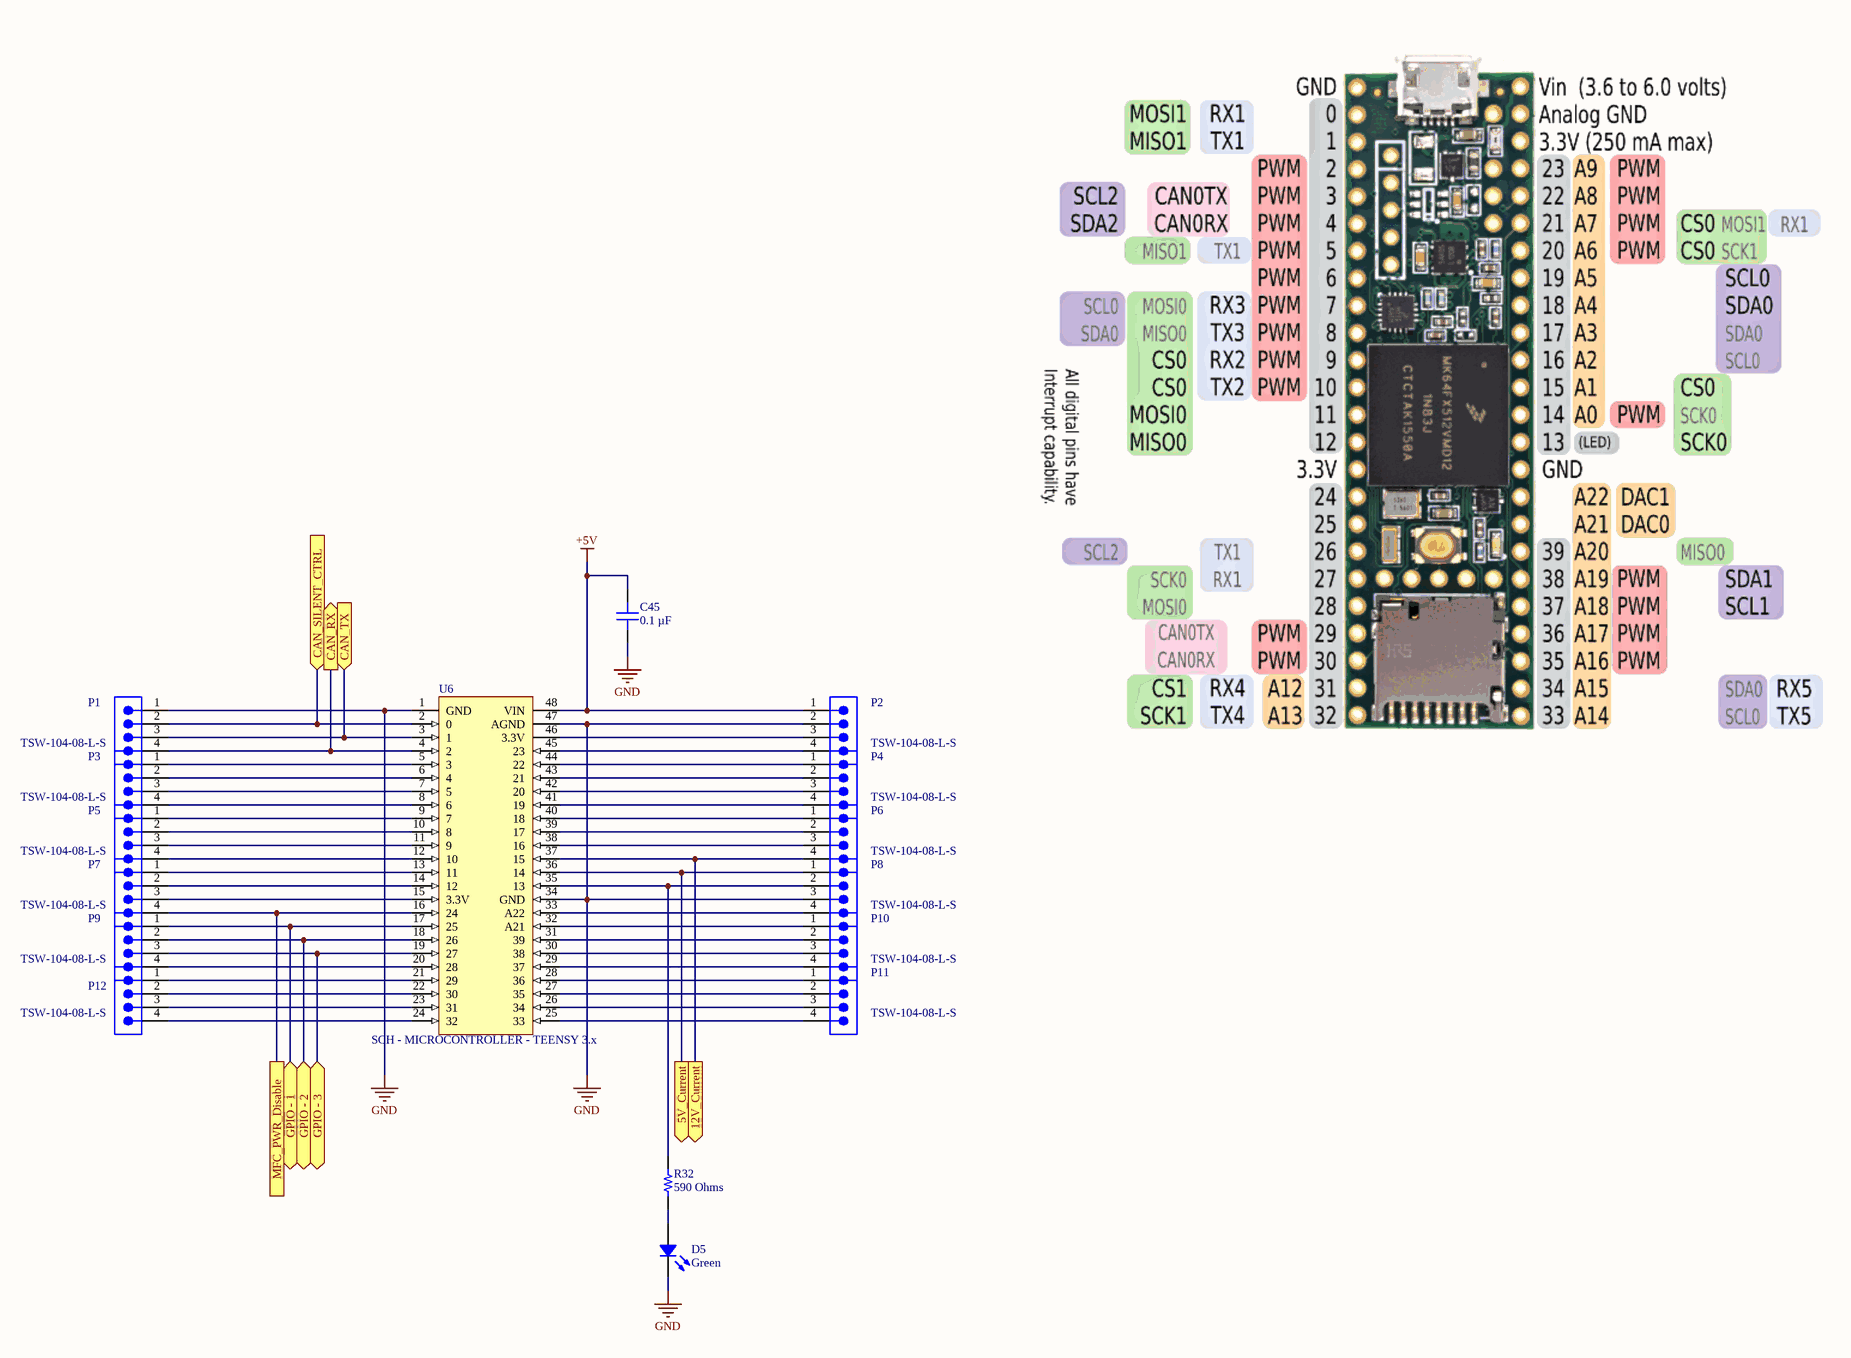
[diagram p3: Microcontroller.SchDoc]

### Parts
C45  0.1 µF  [CAP 0603_1608]
D5  Green  [LED 0603_1608 GREEN]
P1  TSW-104-08-L-S  [SMTC-TSW-104-08-X-S]
P2  TSW-104-08-L-S  [SMTC-TSW-104-08-X-S]
P3  TSW-104-08-L-S  [SMTC-TSW-104-08-X-S]
P4  TSW-104-08-L-S  [SMTC-TSW-104-08-X-S]
P5  TSW-104-08-L-S  [SMTC-TSW-104-08-X-S]
P6  TSW-104-08-L-S  [SMTC-TSW-104-08-X-S]
P7  TSW-104-08-L-S  [SMTC-TSW-104-08-X-S]
P8  TSW-104-08-L-S  [SMTC-TSW-104-08-X-S]
P9  TSW-104-08-L-S  [SMTC-TSW-104-08-X-S]
P10  TSW-104-08-L-S  [SMTC-TSW-104-08-X-S]
P11  TSW-104-08-L-S  [SMTC-TSW-104-08-X-S]
P12  TSW-104-08-L-S  [SMTC-TSW-104-08-X-S]
R32  590 Ohms  [RES 0603_1608]
U6  SCH - MICROCONTROLLER - TEENSY 3.x  [PCB - THRU - TEENSY 3.x]

### Ports
5V_Current (out), 12V_Current (out), CAN_RX (out), CAN_SILENT_CTRL (in), CAN_TX (in), GPIO - 1 (bidir), GPIO - 2 (bidir), GPIO - 3 (bidir), MFC_PWR_Disable

### Nets
+5V: C45.1 P2.1 U6.48(VIN)
GND: C45.2 D5.2 P1.1 P2.2 P8.3 U6.1(GND) U6.34(GND) U6.47(AGND)
NetD5_1: D5.1 R32.1
NetJ1_18: P9.1 U6.17(25) ; port GPIO - 1
NetJ1_19: P9.2 U6.18(26) ; port GPIO - 2
NetJ1_20: P9.3 U6.19(27) ; port GPIO - 3
NetP1_2: P1.2 U6.2(0) ; port CAN_SILENT_CTRL
NetP1_3: P1.3 U6.3(1) ; port CAN_TX
NetP1_4: P1.4 U6.4(2) ; port CAN_RX
NetP2_3: P2.3 U6.46(3.3V)
NetP2_4: P2.4 U6.45(23)
NetP3_1: P3.1 U6.5(3)
NetP3_2: P3.2 U6.6(4)
NetP3_3: P3.3 U6.7(5)
NetP3_4: P3.4 U6.8(6)
NetP4_1: P4.1 U6.44(22)
NetP4_2: P4.2 U6.43(21)
NetP4_3: P4.3 U6.42(20)
NetP4_4: P4.4 U6.41(19)
NetP5_1: P5.1 U6.9(7)
NetP5_2: P5.2 U6.10(8)
NetP5_3: P5.3 U6.11(9)
NetP5_4: P5.4 U6.12(10)
NetP6_1: P6.1 U6.40(18)
NetP6_2: P6.2 U6.39(17)
NetP6_3: P6.3 U6.38(16)
NetP6_4: P6.4 U6.37(15) ; port 12V_Current
NetP7_1: P7.1 U6.13(11)
NetP7_2: P7.2 U6.14(12)
NetP7_3: P7.3 U6.15(3.3V)
NetP7_4: P7.4 U6.16(24) ; port MFC_PWR_Disable
NetP8_1: P8.1 U6.36(14) ; port 5V_Current
NetP8_2: P8.2 R32.2 U6.35(13)
NetP8_4: P8.4 U6.33(A22)
NetP9_4: P9.4 U6.20(28)
NetP10_1: P10.1 U6.32(A21)
NetP10_2: P10.2 U6.31(39)
NetP10_3: P10.3 U6.30(38)
NetP10_4: P10.4 U6.29(37)
NetP11_1: P11.1 U6.28(36)
NetP11_2: P11.2 U6.27(35)
NetP11_3: P11.3 U6.26(34)
NetP11_4: P11.4 U6.25(33)
NetP12_1: P12.1 U6.21(29)
NetP12_2: P12.2 U6.22(30)
NetP12_3: P12.3 U6.23(31)
NetP12_4: P12.4 U6.24(32)

### Notes on the sheet
- Title
- Size:
- Date:
- File:
- A2
- Number:
- Time:
- Revision:
- Sheet
- of

### Library data of the parts
C45 = CL10B104KB8NNWC: as C1 on sheet Power-Supplies; Part Number: CL10B104KB8NNWC; Value: 0.1 µF; Applications: General Purpose; Capacitance: 0.1 µF; componentlink1description: Datasheet; componentlink1url: http://www.samsungsem.com/kr/support/product-search/mlcc/CL10B104KB8NNWC.jsp; componentlink2description: DigiKey Link; componentlink2url: https://www.digikey.com/en/products/detail/samsung-electro-mechanics/CL10B104KB8NNWC/3887593; Device Package: 0603 (1608 Metric); lastupdated: 3/8/2022 9:16:52 PM; Lifecycle Status: Active; Minimum Order: 1; Mounting Type: Surface Mount, MLCC; Operating Temperature: -55°C ~ 125°C; Package / Case: 0603 (1608 Metric); packaging: CutTape; partid: 16078; Part Status: Active; price: 0.01; series: CL; Size / Dimension: 0.063" L x 0.031" W (1.60mm x 0.80mm); Supplier 1: DigiKey; Supplier Part Number 1: 1276-1935-1-ND; Temperature Coefficient: X7R; Thickness (Max): 0.035" (0.90mm); Voltage - Rated: 50V
D5 = LTST-C193KGKT-5A: as D2 on sheet Sensors; Part Number: LTST-C193KGKT-5A; Color: Green; ComponentLink1Description: Datasheet; ComponentLink1URL: http://optoelectronics.liteon.com/upload/download/DS22-2007-0094/LTST-C193KGKT-5A.PDF; ComponentLink2Description: DigiKey Link; ComponentLink2URL: http://digikey.com/product-detail/en/lite-on-inc/LTST-C193KGKT-5A/160-1828-1-ND/2356247; Device Package: 0603 (1608 Metric); Height (Max): 0.45mm; LastUpdated: 9/2/2020 1:20:41 AM; Lens Transparency: Clear; Lifecycle Status: Active; Minimum Order: 1; Mounting Type: Surface Mount; Package / Case: 0603 (1608 Metric); Packaging: TapeAndReel; PartId: 694; Part Status: Active; Price: 0.06; Series: -; Size / Dimension: 1.60mm L x 0.80mm W; Supplier 1: DigiKey; Supplier Part Number 1: 160-1828-1-ND; Supplier Device Package: Chip LED; Value: Green
P1-P12 = CMP-1024-00358-1: 0.025" SQ Post Header, Through-hole, Vertical, -55 to 125 degC, 2.54 mm Pitch, 4-Pin, Male, RoHS; Manufacturer: Samtec; Pitch: 2.54 mm; PartNumber: TSW-104-08-L-S; RoHS: True; Temperature Range: -55 to 125 degC; PackageDescription: .025[0.64] SQ. Post Terminal Strip Assembly; Orientation: Vertical; ComponentLink2URL: http://www.samtec.com/documents/webfiles/pdf/TSW_TH.PDF; ComponentLink1Description: Manufacturer URL; ComponentLink2Description: Datasheet; PackageVersion: DM, 8/1988; ComponentLink3URL: http://www.samtec.com/documents/webfiles/cpdf/TSW-XXX-XX-XXX-X-XX-XXX-MKT.pdf; Mounting Technology: Through-hole; PackageReference: TSW-104-08-X-S; ComponentLink3Description: Package Specification; ComponentLink1URL: http://www.samtec.com; DatasheetVersion: F-214
R32 = RMCF0603FT590R: as R27 on sheet Sensors; Part Number: RMCF0603FT590R; Value: 590 Ohms; ComponentLink1Description: Datasheet; ComponentLink1URL: https://www.seielect.com/catalog/sei-rmcf_rmcp.pdf; ComponentLink2Description: DigiKey Link; ComponentLink2URL: http://digikey.com/product-detail/en/stackpole-electronics-inc/RMCF0603FT590R/RMCF0603FT590RCT-ND/2418096; Composition: Thick Film; Device Package: 0603 (1608 Metric); Features: Automotive AEC-Q200; Height - Seated (Max): 0.022" (0.55mm); LastUpdated: 9/2/2020 1:09:40 AM; Lifecycle Status: Active; Minimum Order: 1; Number of Terminations: 2; Operating Temperature: -55°C ~ 155°C; Package / Case: 0603 (1608 Metric); Packaging: CutTape; PartId: 23847; Part Status: Active; Price: 0.10; Ratings: AEC-Q200; Resistance: 590 Ohms; Series: RMCF; Size / Dimension: 0.061" L x 0.031" W (1.55mm x 0.80mm); Supplier 1: DigiKey; Supplier Part Number 1: RMCF0603FT590RCT-ND; Supplier Device Package: 0603; Tolerance: ±1%

## Nets that join several sheets
+5_Supply: Power-Supplies (9 pins), Sensors (R24.1 R27.2 R30.2)
+5_Supply_Sense: Interfaces (C38.2 C39.2 J1.9 J1.10), Sensors (R24.2 R31.2)
+5V: Power-Supplies (8 pins), Interfaces (C40.2 C41.2 U4.3 U4.5), Sensors (C44.1 U5.A2 U5.B2 U5.C2), Microcontroller (C45.1 P2.1 U6.48)
+12_Supply: Power-Supplies (5 pins), Sensors (R23.1 R26.2 R28.2)
+12_Supply_Sense: Interfaces (C36.2 C37.2 J1.5 J1.6), Sensors (R23.2 R29.2)
+ShorePower: Power-Supplies (18 pins), Interfaces (7 pins), Sensors (R25.2)
GND: Power-Supplies (40 pins), Interfaces (33 pins), Sensors (7 pins), Microcontroller (8 pins)
NetJ1_18: Interfaces (J1.18), Microcontroller (P9.1 U6.17)
NetJ1_19: Interfaces (J1.19), Microcontroller (P9.2 U6.18)
NetJ1_20: Interfaces (J1.20), Microcontroller (P9.3 U6.19)
NetP1_2: Interfaces (R12.2), Microcontroller (P1.2 U6.2)
NetP1_3: Interfaces (U4.1), Microcontroller (P1.3 U6.3)
NetP1_4: Interfaces (U4.4), Microcontroller (P1.4 U6.4)
NetP6_4: Sensors (U5.D3), Microcontroller (P6.4 U6.37)
NetP7_4: Interfaces (R22.2), Microcontroller (P7.4 U6.16)
NetP8_1: Sensors (U5.A3), Microcontroller (P8.1 U6.36)